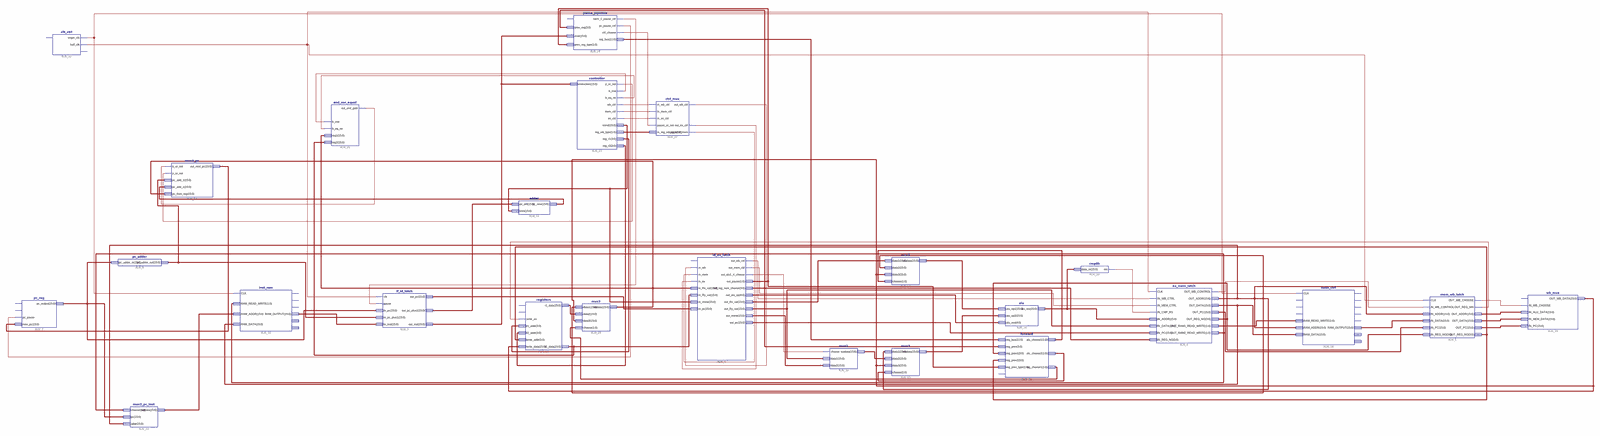
[diagram p0: schematic sheet 1, whole]
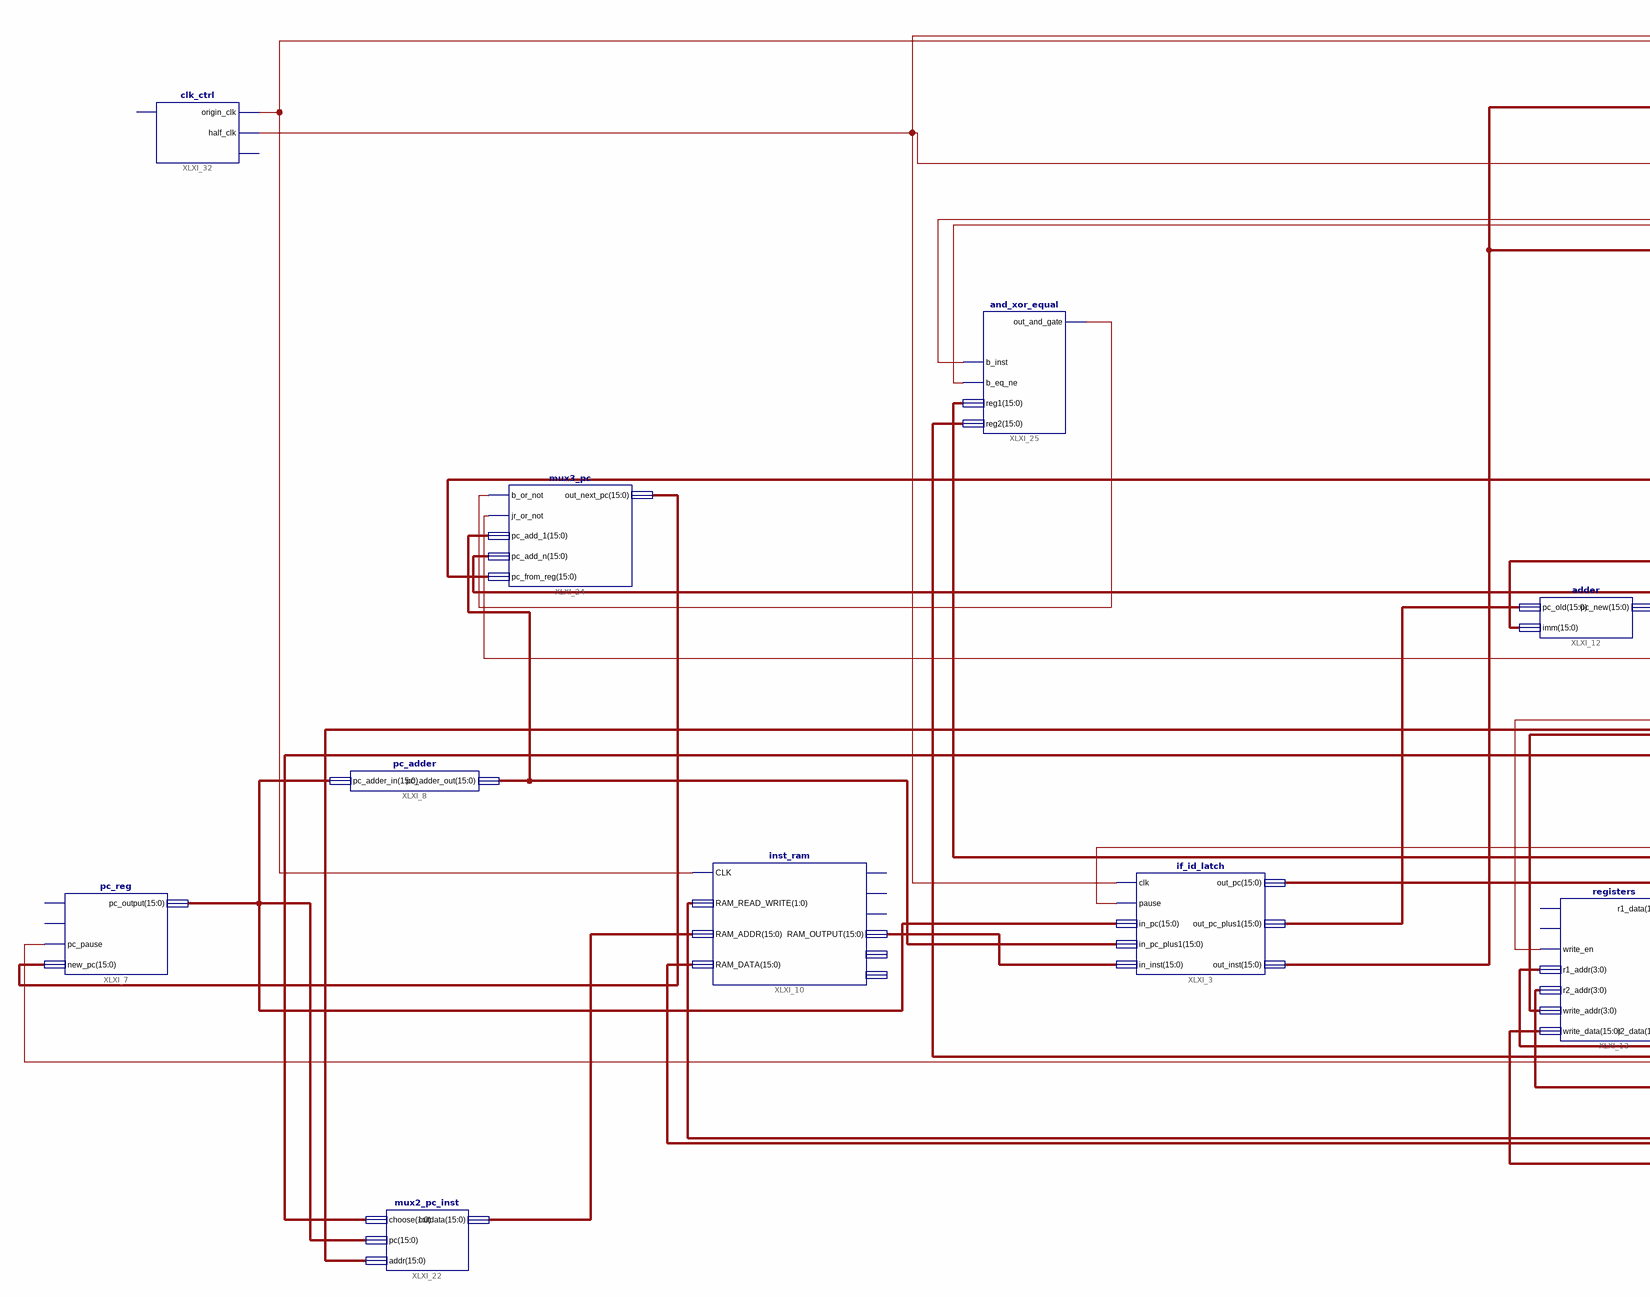
[diagram p1: schematic sheet 1, left part]
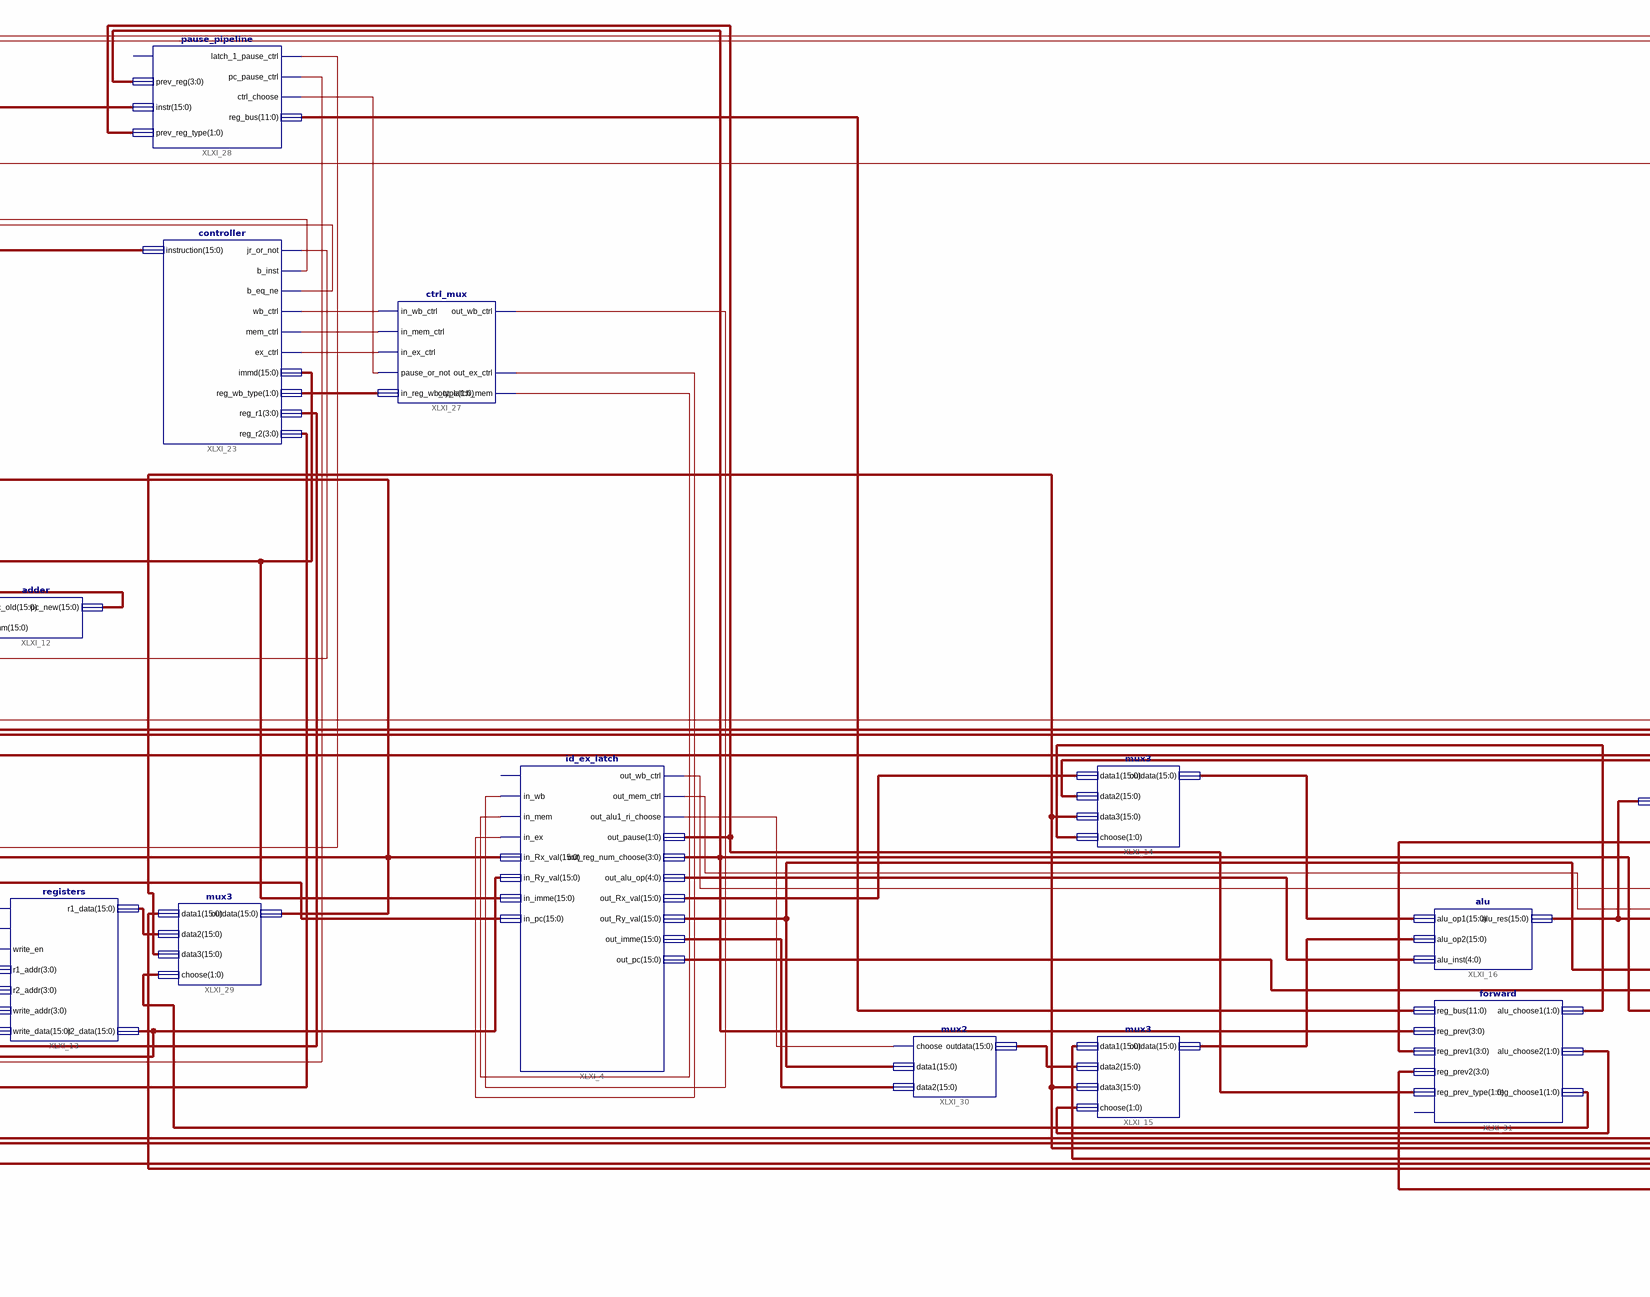
[diagram p2: schematic sheet 1, centre part]
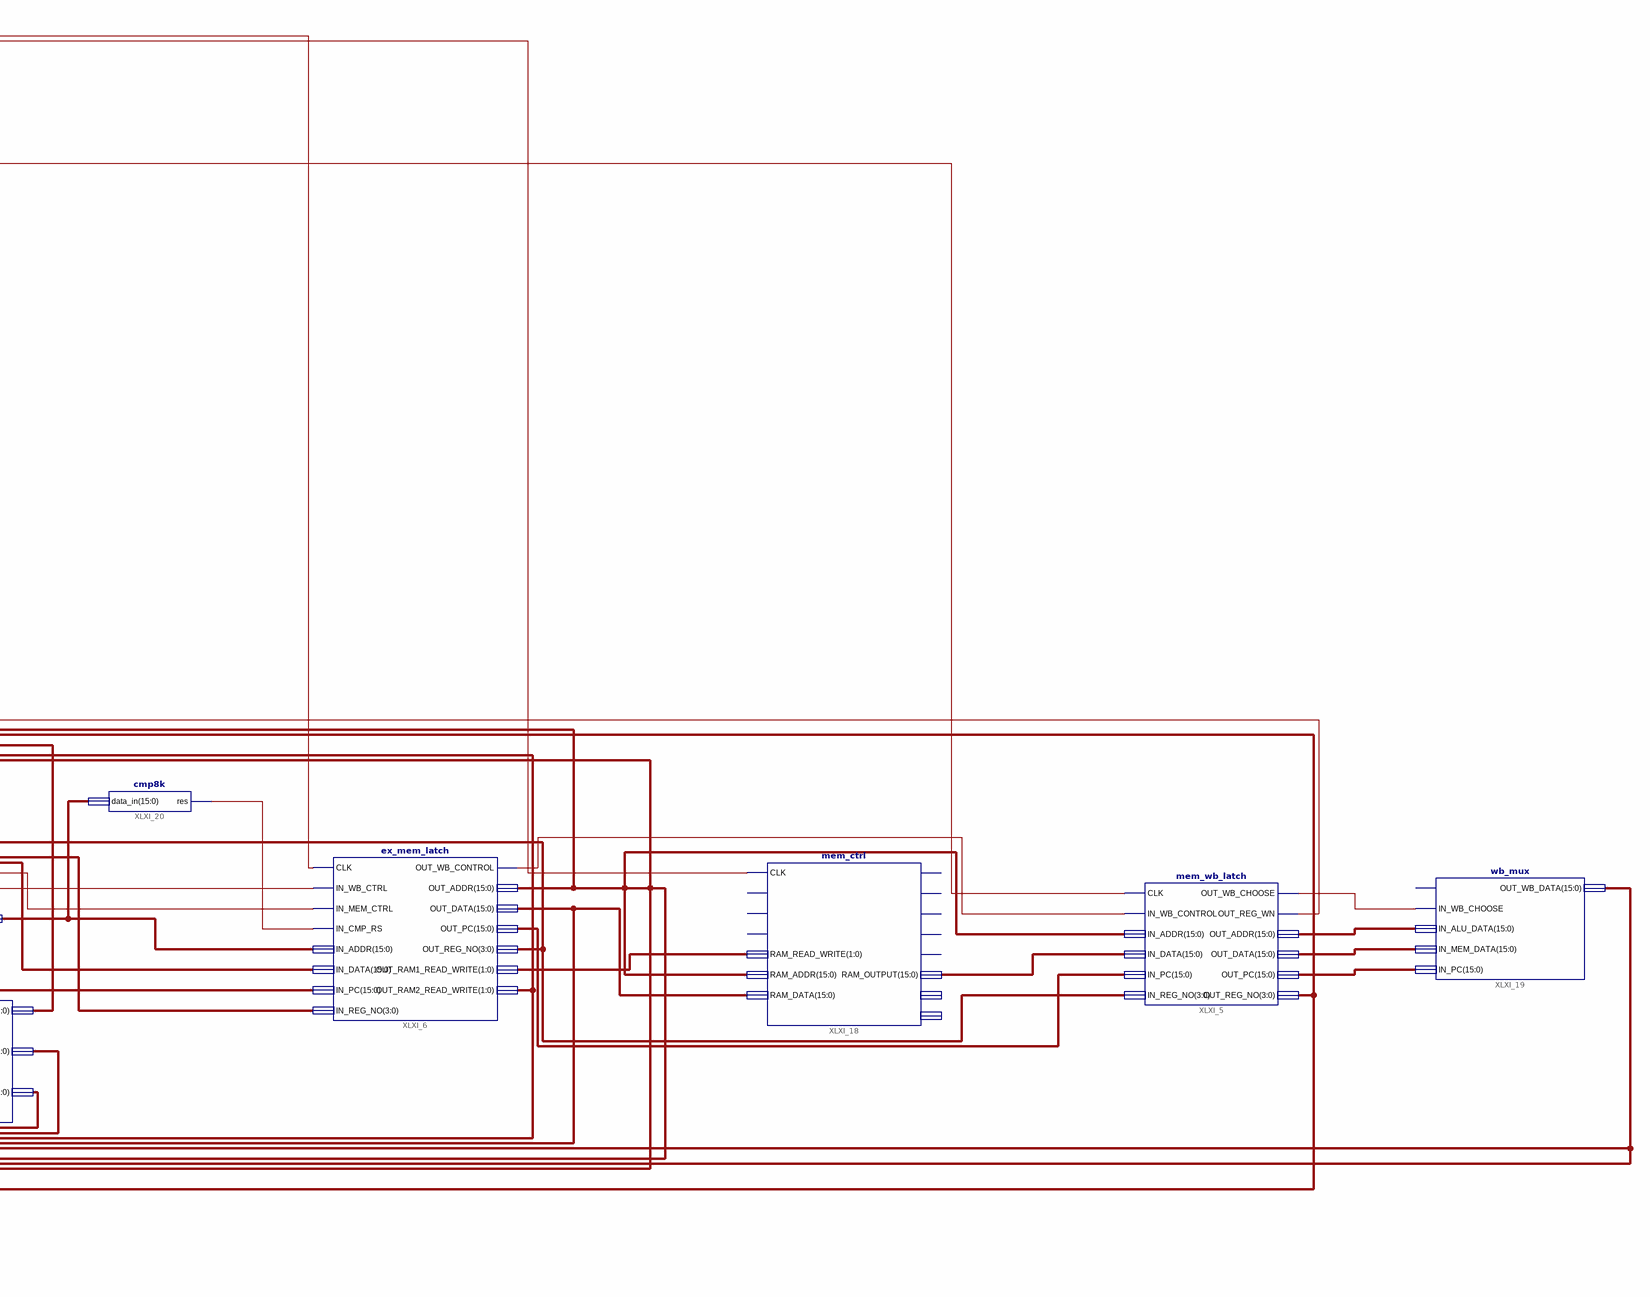
[diagram p3: schematic sheet 1, right part]
// Xilinx ISE schematic cpu410.sch (spartan3e) as structural Verilog: 25 symbols, 0 ports
module cpu410 (
);

  wire XLXN_11, XLXN_14, XLXN_15, XLXN_16, XLXN_17, XLXN_31, XLXN_32, XLXN_42, XLXN_43, XLXN_45, XLXN_47,
       XLXN_48, XLXN_54, XLXN_56, XLXN_58, XLXN_59, XLXN_60, XLXN_74, XLXN_98, XLXN_101, XLXN_102, XLXN_105;
  wire [1:0] XLXN_6, XLXN_20, XLXN_61, XLXN_62, XLXN_82, XLXN_83, XLXN_84;
  wire [3:0] XLXN_10, XLXN_68, XLXN_69, XLXN_81, XLXN_104;
  wire [4:0] XLXN_70;
  wire [11:0] XLXN_85;
  wire [15:0] XLXN_2, XLXN_3, XLXN_4, XLXN_5, XLXN_8, XLXN_9, XLXN_12, XLXN_18, XLXN_21, XLXN_22, XLXN_23,
       XLXN_25, XLXN_28, XLXN_29, XLXN_35, XLXN_36, XLXN_38, XLXN_63, XLXN_64, XLXN_65, XLXN_71, XLXN_72,
       XLXN_73, XLXN_75, XLXN_76, XLXN_77, XLXN_88, XLXN_99, XLXN_103;

  if_id_latch XLXI_3 (
    .clk(XLXN_102), .pause(XLXN_58), .in_pc(XLXN_18), .in_pc_plus1(XLXN_22), .in_inst(XLXN_21),
    .out_pc(XLXN_103), .out_pc_plus1(XLXN_23), .out_inst(XLXN_29));
  id_ex_latch XLXI_4 (
    .in_wb(XLXN_47), .in_mem(XLXN_60), .in_ex(XLXN_45), .in_Rx_val(XLXN_65), .in_Ry_val(XLXN_63),
    .in_imme(XLXN_38), .in_pc(XLXN_103), .out_wb_ctrl(XLXN_17), .out_mem_ctrl(XLXN_16),
    .out_alu1_ri_choose(XLXN_74), .out_pause(XLXN_62), .out_reg_num_choose(XLXN_81), .out_alu_op(XLXN_70),
    .out_Rx_val(XLXN_71), .out_Ry_val(XLXN_72), .out_imme(XLXN_73), .out_pc(XLXN_25));  // open: clk
  mem_wb_latch XLXI_5 (
    .CLK(XLXN_102), .IN_WB_CONTROL(XLXN_11), .IN_ADDR(XLXN_88), .IN_DATA(XLXN_5), .IN_PC(XLXN_9),
    .IN_REG_NO(XLXN_10), .OUT_WB_CHOOSE(XLXN_14), .OUT_REG_WN(XLXN_98), .OUT_ADDR(XLXN_3), .OUT_DATA(XLXN_2),
    .OUT_PC(XLXN_4), .OUT_REG_NO(XLXN_104));
  ex_mem_latch XLXI_6 (
    .CLK(XLXN_102), .IN_WB_CTRL(XLXN_17), .IN_MEM_CTRL(XLXN_16), .IN_CMP_RS(XLXN_15), .IN_ADDR(XLXN_12),
    .IN_DATA(XLXN_72), .IN_PC(XLXN_25), .IN_REG_NO(XLXN_81), .OUT_WB_CONTROL(XLXN_11), .OUT_ADDR(XLXN_88),
    .OUT_DATA(XLXN_8), .OUT_PC(XLXN_9), .OUT_REG_NO(XLXN_10), .OUT_RAM1_READ_WRITE(XLXN_6),
    .OUT_RAM2_READ_WRITE(XLXN_20));
  pc_reg XLXI_7 (.pc_pause(XLXN_59), .new_pc(XLXN_35), .pc_output(XLXN_18));  // open: rst, clk
  pc_adder XLXI_8 (.pc_adder_in(XLXN_18), .pc_adder_out(XLXN_22));
  inst_ram XLXI_10 (
    .CLK(XLXN_101), .RAM_READ_WRITE(XLXN_20), .RAM_ADDR(XLXN_28), .RAM_DATA(XLXN_8), .RAM_OUTPUT(XLXN_21));  // open: Ram2Data, Ram2OE, Ram2WE, Ram2EN, Ram2Addr
  adder XLXI_12 (.pc_old(XLXN_23), .imm(XLXN_38), .pc_new(XLXN_36));
  registers XLXI_13 (
    .write_en(XLXN_98), .r1_addr(XLXN_68), .r2_addr(XLXN_69), .write_addr(XLXN_104), .write_data(XLXN_99),
    .r1_data(XLXN_64), .r2_data(XLXN_63));  // open: clk, rst
  mux3 XLXI_14 (.data1(XLXN_71), .data2(XLXN_88), .data3(XLXN_99), .choose(XLXN_82), .outdata(XLXN_76));
  mux3 XLXI_15 (.data1(XLXN_88), .data2(XLXN_75), .data3(XLXN_99), .choose(XLXN_83), .outdata(XLXN_77));
  alu XLXI_16 (.alu_op1(XLXN_76), .alu_op2(XLXN_77), .alu_inst(XLXN_70), .alu_res(XLXN_12));
  mem_ctrl XLXI_18 (
    .CLK(XLXN_101), .RAM_READ_WRITE(XLXN_6), .RAM_ADDR(XLXN_88), .RAM_DATA(XLXN_8), .RAM_OUTPUT(XLXN_5));  // open: data_ready, tbre, tsre, Ram1Data, Ram1OE, Ram1WE, Ram1EN, rdn, wrn, Ram1Addr
  wb_mux XLXI_19 (
    .IN_WB_CHOOSE(XLXN_14), .IN_ALU_DATA(XLXN_3), .IN_MEM_DATA(XLXN_2), .IN_PC(XLXN_4), .OUT_WB_DATA(XLXN_99));  // open: CLK
  cmp8k XLXI_20 (.data_in(XLXN_12), .res(XLXN_15));
  mux2_pc_inst XLXI_22 (.choose(XLXN_20), .pc(XLXN_18), .addr(XLXN_88), .outdata(XLXN_28));
  controller XLXI_23 (
    .instruction(XLXN_29), .jr_or_not(XLXN_31), .b_inst(XLXN_32), .b_eq_ne(XLXN_54), .wb_ctrl(XLXN_42),
    .mem_ctrl(XLXN_105), .ex_ctrl(XLXN_43), .immd(XLXN_38), .reg_wb_type(XLXN_61), .reg_r1(XLXN_68),
    .reg_r2(XLXN_69));
  mux3_pc XLXI_24 (
    .b_or_not(XLXN_56), .jr_or_not(XLXN_31), .pc_add_1(XLXN_22), .pc_add_n(XLXN_36), .pc_from_reg(XLXN_65),
    .out_next_pc(XLXN_35));
  and_xor_equal XLXI_25 (.b_inst(XLXN_32), .b_eq_ne(XLXN_54), .reg1(XLXN_65), .reg2(XLXN_63), .out_and_gate(XLXN_56));
  ctrl_mux XLXI_27 (
    .in_wb_ctrl(XLXN_42), .in_mem_ctrl(XLXN_105), .in_ex_ctrl(XLXN_43), .pause_or_not(XLXN_48),
    .in_reg_wb_type(XLXN_61), .out_wb_ctrl(XLXN_47), .out_ex_ctrl(XLXN_45), .out_latch_mem(XLXN_60));
  pause_pipeline XLXI_28 (
    .prev_reg(XLXN_81), .instr(XLXN_29), .prev_reg_type(XLXN_62), .latch_1_pause_ctrl(XLXN_58),
    .pc_pause_ctrl(XLXN_59), .ctrl_choose(XLXN_48), .reg_bus(XLXN_85));  // open: clk
  mux3 XLXI_29 (.data1(XLXN_88), .data2(XLXN_64), .data3(XLXN_99), .choose(XLXN_84), .outdata(XLXN_65));
  mux2 XLXI_30 (.choose(XLXN_74), .data1(XLXN_72), .data2(XLXN_73), .outdata(XLXN_75));
  forward XLXI_31 (
    .reg_bus(XLXN_85), .reg_prev(XLXN_81), .reg_prev1(XLXN_10), .reg_prev2(XLXN_104),
    .reg_prev_type(XLXN_62), .alu_choose1(XLXN_82), .alu_choose2(XLXN_83), .reg_choose1(XLXN_84));  // open: clk
  clk_ctrl XLXI_32 (.origin_clk(XLXN_101), .half_clk(XLXN_102));  // open: clk, quarter_clk
endmodule
